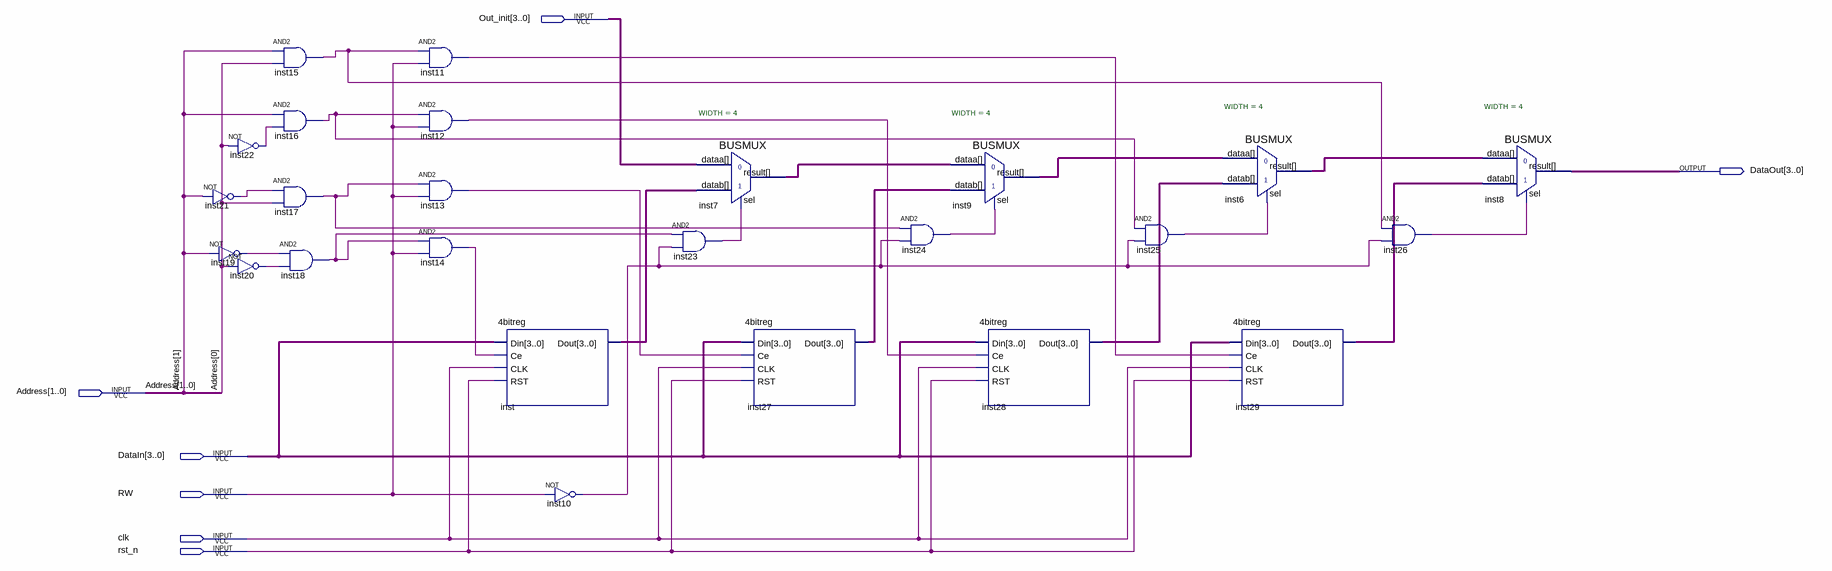
[diagram p0: schematic sheet]
// Quartus schematic practice2.bdf as structural Verilog: 25 symbols, 7 pins
module practice2 (
  input  [3:0] Out_init,
  input  [1:0] Address,
  input  [3:0] DataIn,
  input  RW,
  input  clk,
  input  rst_n,
  output [3:0] DataOut
);

  wire inst10_out, inst11_out, inst12_out, inst13_out, inst14_out, inst15_out, inst16_out, inst17_out,
       inst18_out, inst19_out, inst20_out, inst21_out, inst22_out, inst23_out, inst24_out, inst25_out,
       inst26_out;
  wire [3:0] inst6_result, inst7_result, inst9_result, inst27_dout, inst28_dout, inst29_dout, inst_dout;

  not inst22 (inst22_out, Address[0]);
  not inst21 (inst21_out, Address[1]);
  not inst19 (inst19_out, Address[1]);
  not inst20 (inst20_out, Address[0]);
  and inst15 (inst15_out, Address[1], Address[0]);
  and inst16 (inst16_out, Address[1], inst22_out);
  and inst17 (inst17_out, inst21_out, Address[0]);
  and inst18 (inst18_out, inst19_out, inst20_out);
  and inst11 (inst11_out, inst15_out, RW);
  and inst12 (inst12_out, inst16_out, RW);
  and inst13 (inst13_out, inst17_out, RW);
  and inst14 (inst14_out, inst18_out, RW);
  \4bitreg  inst (.Din(DataIn), .Ce(inst14_out), .CLK(clk), .RST(rst_n), .Dout(inst_dout));
  not inst10 (inst10_out, RW);
  BUSMUX #(.WIDTH(4)) inst7 (.datab(inst_dout), .sel(inst23_out), .dataa(Out_init), .result(inst7_result));
  and inst23 (inst23_out, inst18_out, inst10_out);
  \4bitreg  inst27 (.Din(DataIn), .Ce(inst13_out), .CLK(clk), .RST(rst_n), .Dout(inst27_dout));
  and inst24 (inst24_out, inst17_out, inst10_out);
  BUSMUX #(.WIDTH(4)) inst9 (.datab(inst27_dout), .sel(inst24_out), .dataa(inst7_result), .result(inst9_result));
  \4bitreg  inst28 (.Din(DataIn), .Ce(inst12_out), .CLK(clk), .RST(rst_n), .Dout(inst28_dout));
  and inst25 (inst25_out, inst16_out, inst10_out);
  BUSMUX #(.WIDTH(4)) inst6 (.datab(inst28_dout), .sel(inst25_out), .dataa(inst9_result), .result(inst6_result));
  \4bitreg  inst29 (.Din(DataIn), .Ce(inst11_out), .CLK(clk), .RST(rst_n), .Dout(inst29_dout));
  and inst26 (inst26_out, inst15_out, inst10_out);
  BUSMUX #(.WIDTH(4)) inst8 (.datab(inst29_dout), .sel(inst26_out), .dataa(inst6_result), .result(DataOut));
endmodule
